# Altium project PCB_Project.PrjPcb
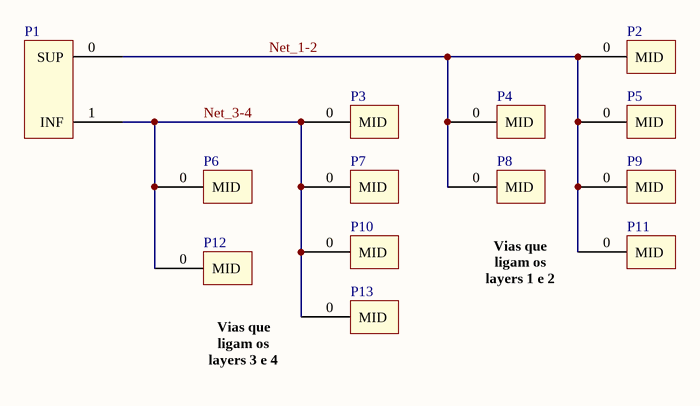
[diagram p0: Nets_Acelerometro.SchDoc]
1 sheet, 13 parts. Net scope: global (net labels, ports and power ports of the same name join across sheets).
Board files: Transdutir_Alinhado.PcbDoc, Tampa_Alinhada.PcbDoc

## Sheet Nets_Acelerometro.SchDoc
size A4; SheetNumber: 1; SheetTotal: 1

### Parts
P1  Pino de saida de dados  [SAIDA_DADOS]  (value not drawn)
P2  Via para conectar  [Via_Conect]  (value not drawn)
P3  Via para conectar  [Via_Conect]  (value not drawn)
P4  Via para conectar  [Via_Conect]  (value not drawn)
P5  Via para conectar  [Via_Conect]  (value not drawn)
P6  Via para conectar  [Via_Conect]  (value not drawn)
P7  Via para conectar  [Via_Conect]  (value not drawn)
P8  Via para conectar  [Via_Conect]  (value not drawn)
P9  Via para conectar  [Via_Conect]  (value not drawn)
P10  Via para conectar  [Via_Conect]  (value not drawn)
P11  Via para conectar  [Via_Conect]  (value not drawn)
P12  Via para conectar  [Via_Conect]  (value not drawn)
P13  Via para conectar  [Via_Conect]  (value not drawn)

### Nets
Net_1-2: P1.0(SUP) P2.0(MID) P4.0(MID) P5.0(MID) P8.0(MID) P9.0(MID) P11.0(MID)
Net_3-4: P1.1(INF) P3.0(MID) P6.0(MID) P7.0(MID) P10.0(MID) P12.0(MID) P13.0(MID)

### Notes on the sheet
- Vias que ligam os layers 1 e 2
- Vias que ligam os layers 3 e 4

### Library data of the parts
P1 = Pin_Duplo
P2-P13 = Pin_Conect